# EasyEDA Pro project CogletESP_2026-02-24.epro, schematic Proto-Coglet
Board Name: Board1; Create Date: 2025-12-02; Page Name: P1; Project Name: CogletESP; Schematic Name: Schematic1; Update Date: 2025-12-12; Company: EasyEDA.com; Page Size: A4; Version: V1.0
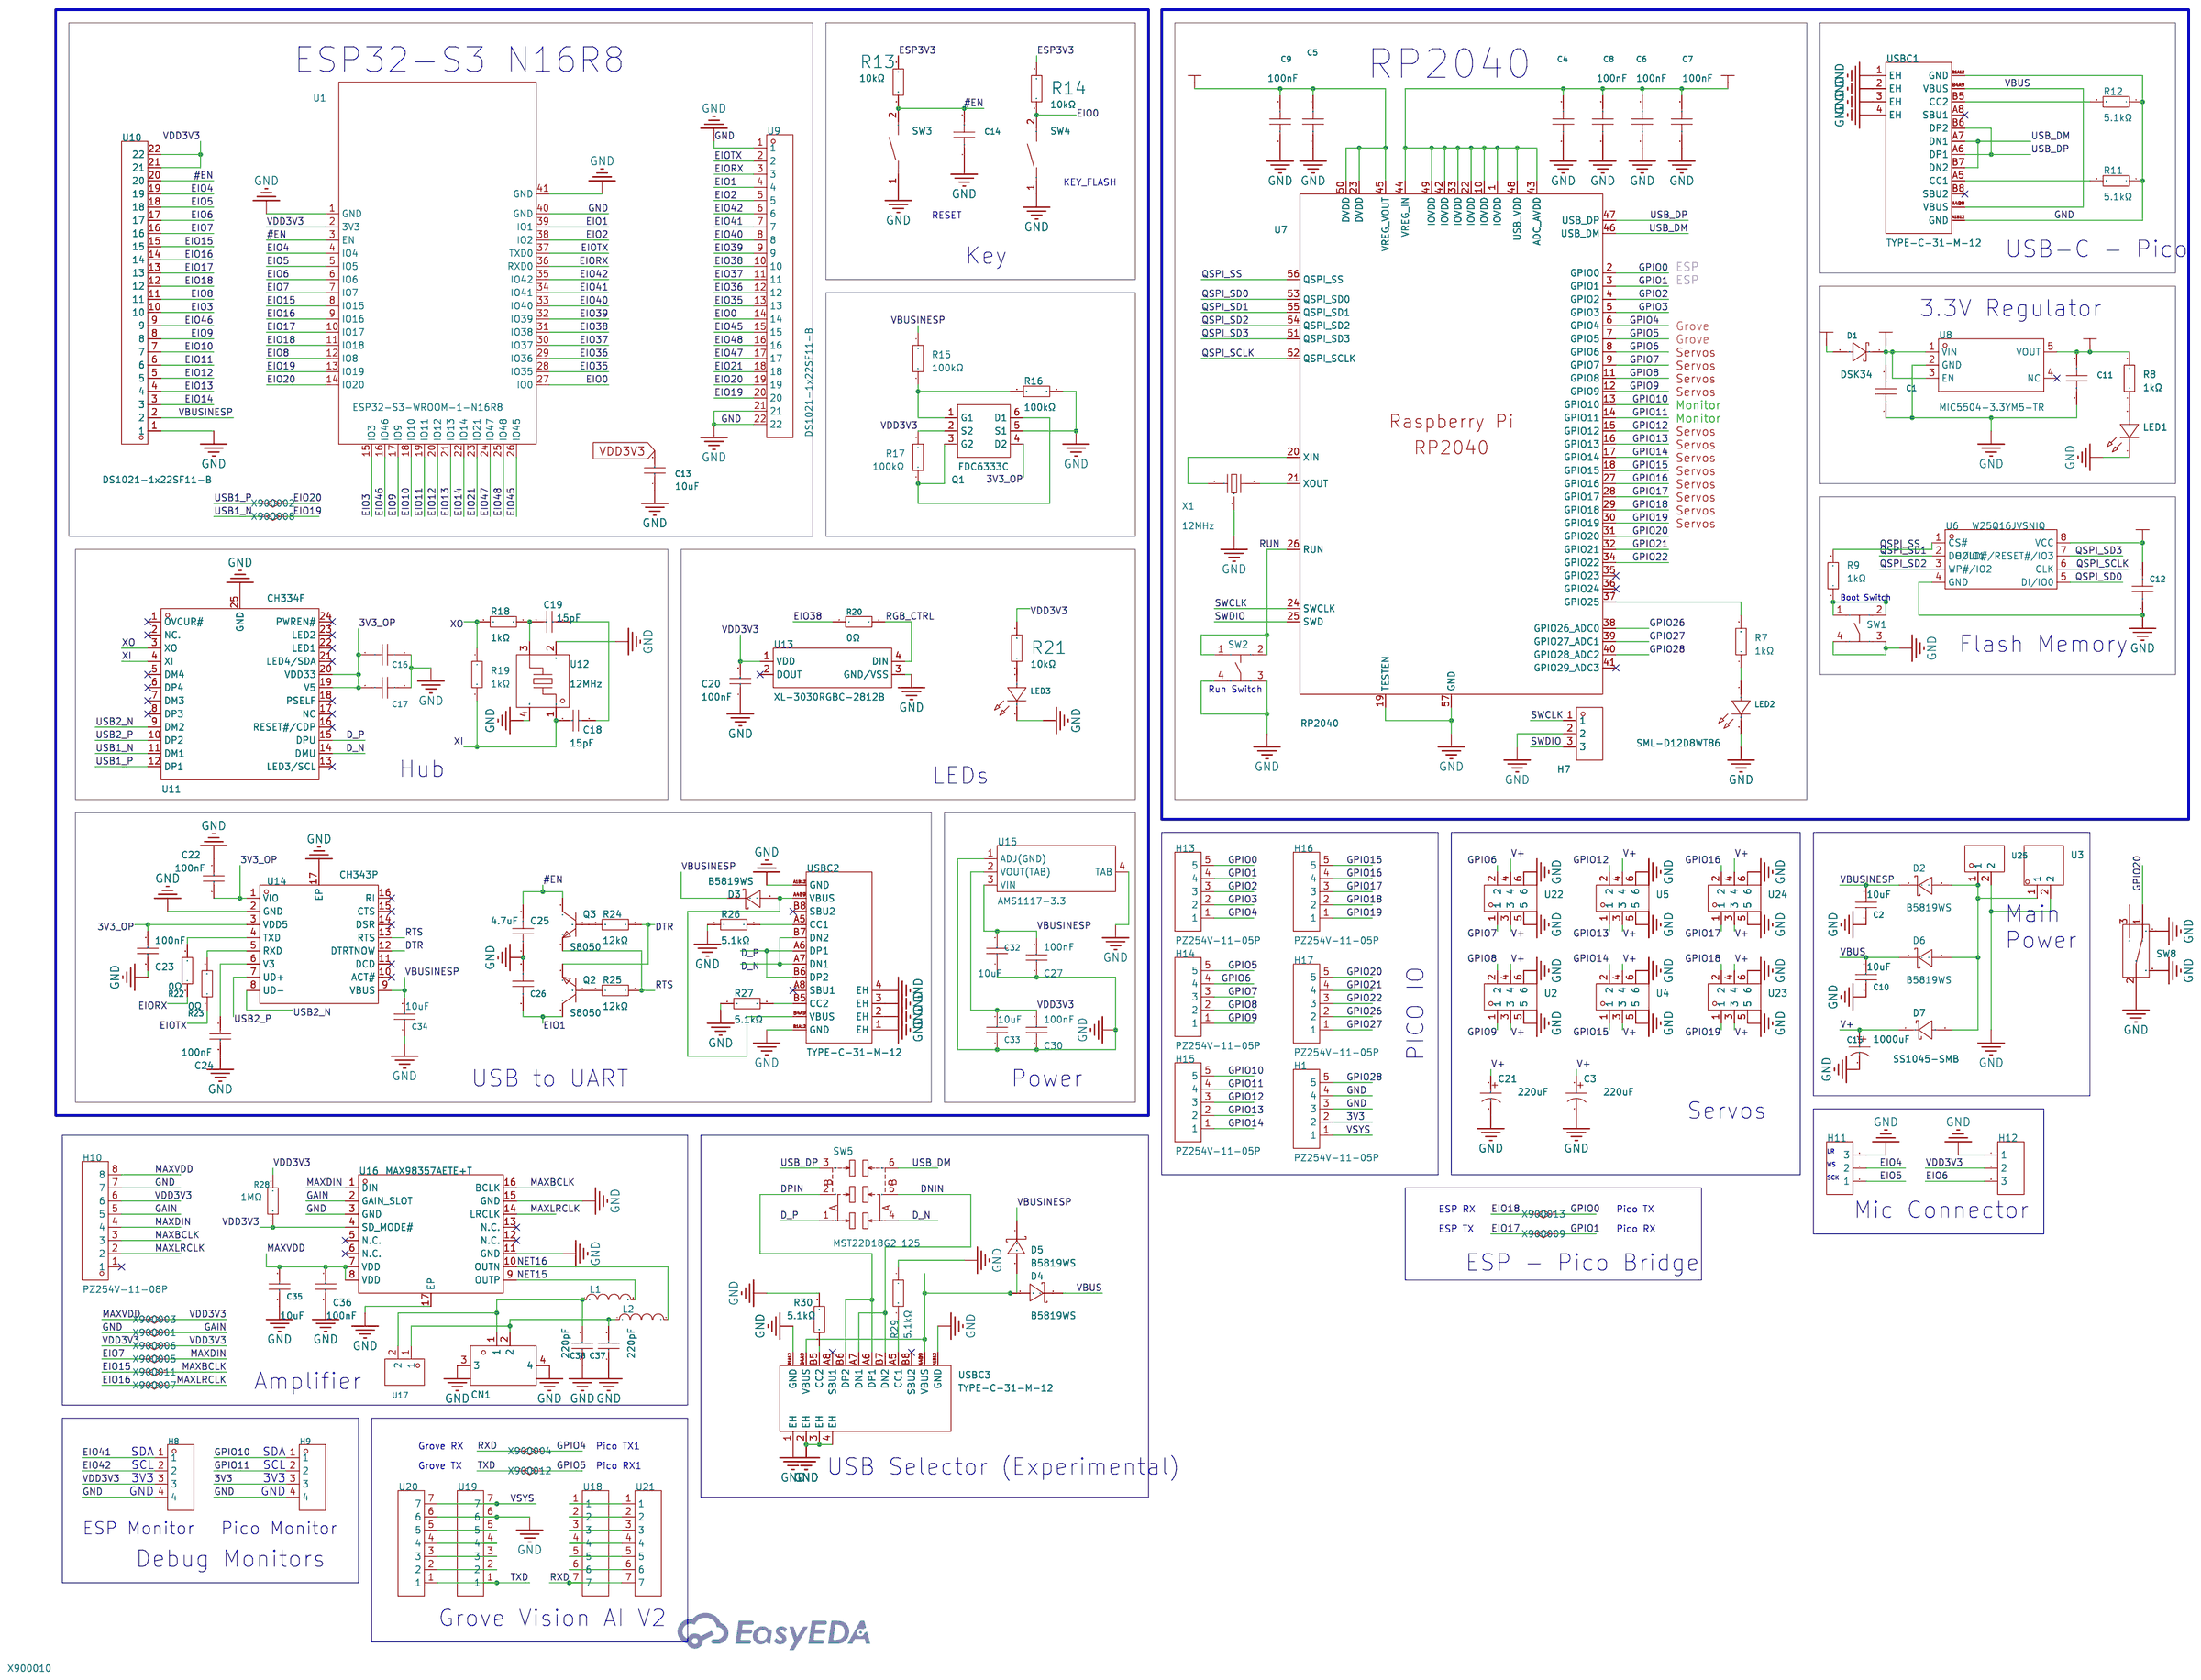
[diagram p1: schematic sheet]

## Parts
C1  1uF  [C0603]
C2  10uF  [C0603]
C3  220uF  [CAP-SMD_BD6.3-L6.6-W6.6-FD]
C4  1uF  [C0603]
C5  1uF  [C0603]
C6  100nF  [C0603]
C7  100nF  [C0603]
C8  100nF  [C0603]
C9  100nF  [C0603]
C10  10uF  [C0603]
C11  1uF  [C0603]
C12  1uF  [C0603]
C13  10uF  [C0805]
C14  1uF  [C0603]
C15  1000uF  [CAP-SMD_BD10.0-L10.3-W10.3-FD]
C16  1uF  [C0603]
C17  1uF  [C0603]
C18  15pF  [C0603]
C19  15pF  [C0603]
C20  100nF  [C0603]
C21  220uF  [CAP-SMD_BD6.3-L6.6-W6.6-FD]
C22  100nF  [C0603]
C23  100nF  [C0603]
C24  100nF  [C0603]
C25  4.7uF  [C0603]
C26  1uF  [C0603]
C27  100nF  [C0603]
C30  100nF  [C0603]
C32  10uF  [C0603]
C33  10uF  [C0603]
C34  10uF  [C0603]
C35  10uF  [C0603]
C36  100nF  [C0603]
C37  220pF  [C0603]
C38  220pF  [C0603]
CN1  HC-1.25-2PWT  [CONN-SMD_2P-P1.25-HC-1.25-2PWT]
D1  DSK34  [SOD-123_L2.8-W1.8-LS3.7-RD]
D2  B5819WS  [SOD-323_L1.8-W1.3-LS2.5-RD]
D3  B5819WS  [SOD-323_L1.8-W1.3-LS2.5-RD]
D4  B5819WS  [SOD-323_L1.8-W1.3-LS2.5-RD]
D5  B5819WS  [SOD-323_L1.8-W1.3-LS2.5-RD]
D6  B5819WS  [SOD-323_L1.8-W1.3-LS2.5-RD]
D7  SS1045-SMB  [SMB_L4.4-W3.6-LS5.3-RD]
H1  PZ254V-11-05P  [HDR-TH_5P-P2.54-V-M]
H7  X6511WV-03H-C60D30  [HDR-TH_3P-P2.54-V-M]  (no BOM)
H8  PZ254V-11-04P  [HDR-TH_4P-P2.54-V-M]
H9  PZ254V-11-04P  [HDR-TH_4P-P2.54-V-M]
H10  PZ254V-11-08P  [HDR-TH_8P-P2.54-V-M]  (no BOM)
H11  2.54-1*3P针  [HDR-TH_3P-P2.54-V-M-1]
H12  2.54-1*3P针  [HDR-TH_3P-P2.54-V-M-1]
H13  PZ254V-11-05P  [HDR-TH_5P-P2.54-V-M]
H14  PZ254V-11-05P  [HDR-TH_5P-P2.54-V-M]
H15  PZ254V-11-05P  [HDR-TH_5P-P2.54-V-M]
H16  PZ254V-11-05P  [HDR-TH_5P-P2.54-V-M]
H17  PZ254V-11-05P  [HDR-TH_5P-P2.54-V-M]
L1  BLM18PG121SN1D  [L0603]
L2  BLM18PG121SN1D  [L0603]
LED1  SML-D12P8WT86  [LED0603-RD_GREEN]
LED2  SML-D12D8WT86  [LED0603-R-RD_AMBER]
LED3  SML-D12D8WT86  [LED0603-R-RD_AMBER]
Q1  FDC6333C  [SOT-23-6_L2.9-W1.6-P0.95-LS2.8-BL]
Q2  S8050  [SOT-23-3_L3.0-W1.7-P0.95-LS2.9-BR]
Q3  S8050  [SOT-23-3_L3.0-W1.7-P0.95-LS2.9-BR]
R7  1kΩ  [R0603]
R8  1kΩ  [R0603]
R9  1kΩ  [R0603]
R11  5.1kΩ  [R0402]
R12  5.1kΩ  [R0402]
R13  10kΩ  [R0603]
R14  10kΩ  [R0603]
R15  100kΩ  [R0603]
R16  100kΩ  [R0603]
R17  100kΩ  [R0603]
R18  1kΩ  [R0603]
R19  1kΩ  [R0603]  (no BOM)
R20  0Ω  [R0603]
R21  10kΩ  [R0603]
R22  0Ω  [R0603]
R23  0Ω  [R0603]
R24  12kΩ  [R0603]
R25  12kΩ  [R0603]
R26  5.1kΩ  [R0402]
R27  5.1kΩ  [R0402]
R28  1MΩ  [R0603]
R29  5.1kΩ  [R0402]
R30  5.1kΩ  [R0402]
SW1  SKRPACE010  [KEY-SMD_4P-L4.2-W3.2-P2.20-LS4.6]
SW2  SKRPACE010  [KEY-SMD_4P-L4.2-W3.2-P2.20-LS4.6]
SW3  TS-1088-AR02016  [SW-SMD_L3.9-W3.0-P4.45]
SW4  TS-1088-AR02016  [SW-SMD_L3.9-W3.0-P4.45]
SW5  MST22D18G2 125  [SW-SMD_MST22D18G2]
SW8  SS-12D02-VG4  [SW-TH_SS-12D02-VG4]
U1  ESP32-S3-WROOM-1-N16R8  [WIRELM-SMD_ESP32-S3-WROOM-1]
U2  HX PZ2.54-3x2P ZZ  [HDR-TH_6P-P2.54-V-M-R3-C2-S2.54_2]
U3  S2B-PH-K-S(LF)(SN)  [CONN-TH_S2B-PH-K-S-LF-SN]
U4  HX PZ2.54-3x2P ZZ  [HDR-TH_6P-P2.54-V-M-R3-C2-S2.54_2]
U5  HX PZ2.54-3x2P ZZ  [HDR-TH_6P-P2.54-V-M-R3-C2-S2.54_2]
U6  W25Q16JVSNIQ  [SOP-8_L4.9-W3.9-P1.27-LS6.0-BL]
U7  RP2040  [LQFN-56_L7.0-W7.0-P0.4-EP]
U8  MIC5504-3.3YM5-TR  [SOT-23-5_L3.0-W1.7-P0.95-LS2.8-TL]
U9  DS1021-1x22SF11-B  [HDR-TH_22P-P2.54-V-M]  (no BOM)
U10  DS1021-1x22SF11-B  [HDR-TH_22P-P2.54-V-M]  (no BOM)
U11  CH334F  [QFN-24_L4.0-W4.0-P0.50-BL-EP2.8]
U12  12MHz  [CRYSTAL-SMD_4P-L3.2-W2.5-BL]
U13  XL-3030RGBC-2812B  [LED-SMD_4P-L3.0-W3.0-P2.00-LS3.1_YKL-3030AY0203Z-001]
U14  CH343P  [TQFN-16_L3.0-W3.0-P0.50-BL-EP1.7]
U15  AMS1117-3.3  [SOT-223-4_L6.5-W3.5-P2.30-LS7.0-BR]
U16  MAX98357AETE+T  [TQFN-16_L3.0-W3.0-P0.50-BL-EP1.5]
U17  KF301-5.0-2P  [CONN-TH_P5.00_KF301-5.0-2P]
U18  HB-PH3-25417PB2GOP  [HDR-TH_7P-P2.54-V-M]
U19  HB-PH3-25417PB2GOP  [HDR-TH_7P-P2.54-V-M]
U20  HB-PH3-25417PB2GOP  [HDR-TH_7P-P2.54-V-M]  (no BOM)
U21  HB-PH3-25417PB2GOP  [HDR-TH_7P-P2.54-V-M]  (no BOM)
U22  HX PZ2.54-3x2P ZZ  [HDR-TH_6P-P2.54-V-M-R3-C2-S2.54_2]
U23  HX PZ2.54-3x2P ZZ  [HDR-TH_6P-P2.54-V-M-R3-C2-S2.54_2]
U24  HX PZ2.54-3x2P ZZ  [HDR-TH_6P-P2.54-V-M-R3-C2-S2.54_2]
U25  KF301-5.0-2P  [CONN-TH_P5.00_KF301-5.0-2P]
USBC1  TYPE-C-31-M-12  [USB-C_SMD-TYPE-C-31-M-12_1]
USBC2  TYPE-C-31-M-12  [USB-C_SMD-TYPE-C-31-M-12_1]
USBC3  TYPE-C-31-M-12  [USB-C_SMD-TYPE-C-31-M-12_1]
X1  12MHz  [CRYSTAL-SMD_3P-L3.2-W1.3-P1.2-BL]

## Library data of the parts
C1 C4 C5 C11 C12 C14 C16 C17 C26 = CL10A105KB8NNNC: Capacitance: Tolerance:±10% Tolerance:±10% Voltage Rated: Temperature Coefficient:; LCSC Part Name: 1uF ±10% 50V; Supplier Part: C15849; Manufacturer: SAMSUNG(三星); Supplier Footprint: 0603; JLCPCB Part Class: Basic Part; Datasheet: https://atta.szlcsc.com/upload/public/pdf/source/20160218/1457707763339.pdf; Supplier: LCSC; Tolerance: ±10%
C2 C10 C32-C35 = CL10A106MO8NQNC: Capacitance:10uF Tolerance:±20% Tolerance:±20% Voltage Rating:16V Temperature Coefficient:X5R; LCSC Part Name: 10uF ±20% 16V; Supplier Part: C92487; Manufacturer: SAMSUNG(三星); Supplier Footprint: 0603; JLCPCB Part Class: Extended Part; Datasheet: https://item.szlcsc.com/datasheet/CL10A106MO8NQNC/93680.html; Supplier: LCSC; Tolerance: ±20%; Voltage Rating: 16V; Temperature Coefficient: X5R
C3 C21 = RVT1A221M0605_C72494: Capacitance: Tolerance:±20% Tolerance:±20% Voltage Rating: Ripple Current: Equivalent Series Resistance(ESR):- Diameter: Height - Seated (Max): Lifetime:2000hrs@105℃ Operating Temperature:-40℃~+105℃ Operating Temperature:-40℃~+105℃; LCSC Part Name: 220uF ±20% 10V; Supplier Part: C72494; Manufacturer: ROQANG(容强); Manufacturer Part: RVT1A221M0605; Supplier Footprint: SMD,D6.3xL5.4mm; JLCPCB Part Class: Extended Part; Datasheet: https://atta.szlcsc.com/upload/public/pdf/source/20170325/1490427950282.pdf; Supplier: LCSC; Tolerance: ±20%; Lifetime: 2000hrs@105℃; Operating Temperature: -40℃~+105℃
C6-C9 = CC0603KRX7R9BB104: Capacitance:100nF Tolerance:±10% Tolerance:±10% Voltage Rating:50V Temperature Coefficient:X7R; LCSC Part Name: 100nF ±10% 50V; Supplier Part: C14663; Manufacturer: YAGEO(国巨); Supplier Footprint: 0603; JLCPCB Part Class: Basic Part; Datasheet: https://item.szlcsc.com/datasheet/CC0603KRX7R9BB104/15331.html; Supplier: LCSC; Tolerance: ±10%; Temperature Coefficient: X7R; Voltage Rating: 50V
C13 = CL21A106KOQNNNE: Capacitance:10uF Tolerance:±10% Tolerance:±10% Voltage Rating:16V Temperature Coefficient:X5R; LCSC Part Name: 10uF ±10% 16V; Supplier Part: C1713; Manufacturer: SAMSUNG(三星); Supplier Footprint: 0805; JLCPCB Part Class: Extended Part; Datasheet: https://item.szlcsc.com/datasheet/CL21A106KOQNNNE/2065.html; Supplier: LCSC; Tolerance: ±10%; Voltage Rating: 16V; Temperature Coefficient: X5R
C15 = RVT1C102M1010: Capacitance: Tolerance:±20% Tolerance:±20% Rated Voltage: Ripple Current:- Equivalent Series Resistance(ESR):- φD: L: Lifetime @ Temp:2000hrs@105℃ Operating Temperature:-55℃~+105℃ Operating Temperature:-55℃~+105℃; LCSC Part Name: 1000uF ±20% 16V; Supplier Part: C3359; Manufacturer: HONOR(荣誉); Supplier Footprint: SMD,D10xL10.2mm; JLCPCB Part Class: Extended Part; Datasheet: https://atta.szlcsc.com/upload/public/pdf/source/20210521/C113284_25C86AE95FB541053FE695F13EA8E7D0.pdf; Supplier: LCSC; Tolerance: ±20%; Lifetime @ Temp: 2000hrs@105℃; Operating Temperature: -55℃~+105℃
C18 C19 = CL10C150JB8NNNC: Capacitance:15pF Tolerance:±5% Tolerance:±5% Voltage Rating:50V Temperature Coefficient:C0G; LCSC Part Name: 15pF ±5% 50V; Supplier Part: C1644; Manufacturer: SAMSUNG(三星); Supplier Footprint: 0603; JLCPCB Part Class: Basic Part; Datasheet: https://item.szlcsc.com/datasheet/CL10C150JB8NNNC/1996.html; Supplier: LCSC; Tolerance: ±5%; Voltage Rating: 50V; Temperature Coefficient: C0G
C20 C22-C24 C27 C30 C36 = CL10B104KA8NNNC: Capacitance:100nF Tolerance:±10% Tolerance:±10% Voltage Rating:25V Temperature Coefficient:X7R; LCSC Part Name: 100nF ±10% 25V; Supplier Part: C1590; Manufacturer: SAMSUNG(三星); Supplier Footprint: 0603; JLCPCB Part Class: Extended Part; Datasheet: https://item.szlcsc.com/datasheet/CL10B104KA8NNNC/1942.html; Supplier: LCSC; Tolerance: ±10%; Voltage Rating: 25V; Temperature Coefficient: X7R
C25 = CL10A475KO8NNNC: Capacitance:4.7uF Tolerance:±10% Tolerance:±10% Voltage Rating:16V Temperature Coefficient:X5R; LCSC Part Name: 4.7uF ±10% 16V; Supplier Part: C19666; Manufacturer: SAMSUNG(三星); Supplier Footprint: 0603; JLCPCB Part Class: Basic Part; Datasheet: https://item.szlcsc.com/datasheet/CL10A475KO8NNNC/20375.html; Supplier: LCSC; Tolerance: ±10%; Voltage Rating: 16V; Temperature Coefficient: X5R
C37 C38 = CL10B221KB8NNNC: Capacitance:220pF Tolerance:±10% Tolerance:±10% Voltage Rating:50V Temperature Coefficient:X7R; LCSC Part Name: 220pF ±10% 50V; Supplier Part: C1603; Manufacturer: SAMSUNG(三星); Supplier Footprint: 0603; JLCPCB Part Class: Basic Part; Datasheet: https://item.szlcsc.com/datasheet/CL10B221KB8NNNC/1955.html; Supplier: LCSC; Tolerance: ±10%; Voltage Rating: 50V; Temperature Coefficient: X7R
CN1 = HC-1.25-2PWT: Pins Structure:1x2P Pitch:1.25mm Mounting Style:Horizontal attachment Reference Series:PicoBlade(MX 1.25) Number of Pins:2P Number of Rows:1 Number of PINs Per Row:2 Row Spacing:- Current Rating (Max):1A Contact Material:Brass Contact Plating:Tin Operatin; LCSC Part Name: 1x2P 间距:1.25mm 卧贴 系列:PicoBlade(MX 1.25); Supplier Part: C2845379; Manufacturer: HCTL(华灿天禄); Supplier Footprint: SMD,P=1.25mm,卧贴; JLCPCB Part Class: Extended Part; Datasheet: https://atta.szlcsc.com/upload/public/pdf/source/20240930/9508A8292CCC87B0C29E3A028D56E30A.pdf; Supplier: LCSC; Pins Structure: 1x2P; Pitch: 1.25mm; Mounting Style: Horizontal attachment; Reference Series: PicoBlade(MX 1.25); Number of Pins: 2P; Number of Rows: 1; Number of PINs Per Row: 2; Current Rating (Max): 1A; Contact Material: Brass; Contact Plating: Tin; Operating Temperature Range: -40℃~+105℃; Rated Voltage (Max): 125V; Plastic Material: LCP; Flame Retardant Rating: UL94V-0; Supplementary Features: Auxiliary soldering legs; Z-Height of the Board: 3.57mm; X-Length of Bottom Edge on Board (Spacing Line): 7.55mm; Y-Width of Bottom Edge on Board: 5.25mm
D1 = DSK34_C41029: Diode Configuration:Independent Type Forward Voltage (Vf@If):550mV@3A Reverse Voltage (Vr):40V Rectified Current:3A Reverse Leakage Current (Ir):500uA@40V; LCSC Part Name: 电压:40V 电流:3A; Supplier Part: C41029; Manufacturer: MDD(辰达半导体); Supplier Footprint: SOD-123FL; JLCPCB Part Class: Extended Part; Datasheet: https://atta.szlcsc.com/upload/public/pdf/source/20240710/931B7979AEEE628A0AE48522F9F6A0BB.pdf; Supplier: LCSC; Diode Configuration: Independent Type; Forward Voltage (Vf@If): 550mV@3A; Reverse Voltage (Vr): 40V; Rectified Current: 3A; Reverse Leakage Current (Ir): 500uA@40V
D2-D6 = B5819WS_C64886: Diode Configuration:Independent Voltage - Forward(Vf@If):900mV@3A Voltage - DC Reverse(Vr):40V Current - Rectified:1A Reverse Leakage Current (Ir):1mA@40V Operating Junction Temperature Range:-55℃~+125℃ Operating Junction Temperature Range:-55℃~+125℃ Non-; LCSC Part Name: 丝印SL 电压:40V 电流:1A; Supplier Part: C64886; Manufacturer: MDD(辰达半导体); Supplier Footprint: SOD-323; JLCPCB Part Class: Extended Part; Datasheet: https://item.szlcsc.com/datasheet/B5819WS/65956.html; Supplier: LCSC; Diode Configuration: Independent; Voltage - Forward(Vf@If): 900mV@3A; Voltage - DC Reverse(Vr): 40V; Current - Rectified: 1A; Reverse Leakage Current (Ir): 1mA@40V; Operating Junction Temperature Range: -55℃~+125℃; Non-Repetitive Peak Forward Surge Current: 25A
D7 = SS1045-SMB: Diode Configuration:Independent Type Voltage - Forward(Vf@If):550mV@10A Voltage - DC Reverse(Vr):45V Current - Rectified:10A Reverse Leakage Current (Ir):100nA; LCSC Part Name: 电压:45V 电流:10A; Supplier Part: C2903947; Manufacturer: GOODWORK(固得沃克); Supplier Footprint: SMB(DO-214AA); JLCPCB Part Class: Extended Part; Datasheet: https://atta.szlcsc.com/upload/public/pdf/source/20240617/4C132C80E36BDBE9AB2C039856844535.pdf; Supplier: LCSC; Diode Configuration: Independent Type; Voltage - Forward(Vf@If): 550mV@10A; Voltage - DC Reverse(Vr): 45V; Current - Rectified: 10A; Reverse Leakage Current (Ir): 100nA
H1 H13-H17 = PZ254V-11-05P: Pin Structure:1x5P Pitch:2.54mm Row Spacing:- Circluar Pins/Square Pins:Pin Header Mounting Type:Through Hole Number of Rows:1 Number of Pins:5P Current Rating:- Voltage Rating (Max):- Length of Mating Pin:6mm Insulation Height:2.5mm Length of End Connect; LCSC Part Name: 1x5P 间距:2.54mm 方针 直插; Supplier Part: C492404; Manufacturer: XFCN(兴飞); Supplier Footprint: 插件,P=2.54mm; JLCPCB Part Class: Extended Part; Datasheet: https://item.szlcsc.com/datasheet/PZ254V-11-05P/502960.html; Supplier: LCSC; Pin Structure: 1x5P; Pitch: 2.54mm; Circluar Pins/Square Pins: Pin Header; Mounting Type: Through Hole; Number of Rows: 1; Number of Pins: 5P; Length of Mating Pin: 6mm; Insulation Height: 2.5mm; Length of End Connection Pin: 3mm; Contact Material: Brass; Operating Temperature: -40℃~+105℃; Color: Black
H7 = X6511WV-03H-C60D30: Pin Structure:1x3P Pitch:2.54mm Row Spacing:- Circluar Pins/Square Pins:Square Pins Mounting Type:- Number of Rows:Plugin Number of Pins:3P Current Rating (Max):3A Voltage Rating (Max):250V Length of Mating Pin:- Insulation Height:2.5mm Length of End Conn; LCSC Part Name: 1x3P 间距:2.54mm 方针; Supplier Part: C706875; Manufacturer: XKB Connection(中国星坤); Supplier Footprint: 插件,P=2.54mm; JLCPCB Part Class: Extended Part; Datasheet: https://atta.szlcsc.com/upload/public/pdf/source/20221108/2FDDF9C694C8EDC81165E23F2EAAE597.pdf; Supplier: LCSC; Pin Structure: 1x3P; Pitch: 2.54mm; Circluar Pins/Square Pins: Square Pins; Number of Rows: Plugin; Number of Pins: 3P; Current Rating (Max): 3A; Voltage Rating (Max): 250V; Insulation Height: 2.5mm; Contact Plating: Gold; Operating Temperature Range: -40℃~+105℃; Soldering Temperature(Max): 260℃; Color: Black
H8 H9 = PZ254V-11-04P: Pin Structure:1x4P Pitch:2.54mm Row Spacing:- Circluar Pins/Square Pins:Pin Header Mounting Type:Through Hole Number of Rows:1 Number of Pins:4P Current Rating:3A Voltage Rating (Max):250V Length of Mating Pin:6mm Insulation Height:2.5mm Length of End Con; LCSC Part Name: 1x4P 间距:2.54mm 方针 直插; Supplier Part: C2691448; Manufacturer: XFCN(兴飞); Supplier Footprint: 插件,P=2.54mm; JLCPCB Part Class: Extended Part; Datasheet: https://item.szlcsc.com/datasheet/PZ254V-11-04P/2801085.html; Supplier: LCSC; Pin Structure: 1x4P; Pitch: 2.54mm; Circluar Pins/Square Pins: Pin Header; Mounting Type: Through Hole; Number of Rows: 1; Number of Pins: 4P; Current Rating: 3A; Voltage Rating (Max): 250V; Length of Mating Pin: 6mm; Insulation Height: 2.5mm; Length of End Connection Pin: 3mm; Operating Temperature: -40℃~+105℃; Color: Black
H10 = PZ254V-11-08P: Pin Structure:1x8P Pitch:2.54mm Row Spacing:- Circluar Pins/Square Pins:Pin Header Mounting Type:Through Hole Number of Rows:1 Number of Pins:8P Current Rating:- Voltage Rating (Max):- Length of Mating Pin:6mm Insulation Height:2.5mm Length of End Connect; LCSC Part Name: 1x8P 间距:2.54mm 方针 直插; Supplier Part: C492407; Manufacturer: XFCN(兴飞); Supplier Footprint: 插件,P=2.54mm; JLCPCB Part Class: Extended Part; Datasheet: https://item.szlcsc.com/datasheet/PZ254V-11-08P/502963.html; Supplier: LCSC; Pin Structure: 1x8P; Pitch: 2.54mm; Circluar Pins/Square Pins: Pin Header; Mounting Type: Through Hole; Number of Rows: 1; Number of Pins: 8P; Length of Mating Pin: 6mm; Insulation Height: 2.5mm; Length of End Connection Pin: 3mm; Contact Material: Brass; Operating Temperature: -40℃~+105℃; Color: Black
H11 H12 = 2.54-1*3P针: Pin Structure:1x3P Pitch:2.54mm Row Spacing:- Circluar Pins/Square Pins:Pin Header Mounting Type:Through Hole Number of Rows:1 Number of Pins:3P Current Rating:3A Voltage Rating (Max):- Length of Mating Pin:6mm Insulation Height:2.5mm Length of End Connec; LCSC Part Name: 1x3P 间距:2.54mm 方针 直插; Supplier Part: C49257; Manufacturer: BOOMELE(博穆精密); Supplier Footprint: 插件,P=2.54mm; JLCPCB Part Class: Extended Part; Datasheet: https://item.szlcsc.com/datasheet/2.54-1*3P%25E9%2592%2588/50265.html; Supplier: LCSC; Pin Structure: 1x3P; Pitch: 2.54mm; Circluar Pins/Square Pins: Pin Header; Mounting Type: Through Hole; Number of Rows: 1; Number of Pins: 3P; Current Rating: 3A; Length of Mating Pin: 6mm; Insulation Height: 2.5mm; Length of End Connection Pin: 3mm; Contact Material: Brass; Contact Plating: Gold; Operating Temperature: -40℃~+105℃; Color: Black
L1 L2 = BLM18PG121SN1D_C14709: Impedance @ Frequency:120Ω@100MHz Tolerance:±25% Tolerance:±25% DC Resistance(DCR):50mΩ Current Rating:2A Number of Circuits:1 Operating Temperature:-55℃~+125℃ Operating Temperature:-55℃~+125℃; LCSC Part Name: 单路 0603磁珠 阻抗120Ω@100MHz; Supplier Part: C14709; Manufacturer: muRata(村田); Supplier Footprint: 0603; JLCPCB Part Class: Basic Part; Datasheet: https://item.szlcsc.com/datasheet/BLM18PG121SN1D/15379.html; Supplier: LCSC; Impedance @ Frequency: 120Ω@100MHz; Tolerance: ±25%; DC Resistance(DCR): 50mΩ; Current Rating: 2A; Number of Circuits: 1; Operating Temperature: -55℃~+125℃
LED1 = SML-D12P8WT86: Emitted Color:Green-yellow Forward Voltage (VF):2.2V Forward Voltage (VF):2.2V Power Dissipation:54mW Forward Current:20mA Dominant Wavelength:560nm Dominant Wavelength:560nm Peak Wavelength:- Diode Configuration:- Lens Color:白色透镜 Color Temperature:- Colo; LCSC Part Name: 普绿/黄绿; Supplier Part: C510026; Manufacturer: ROHM(罗姆); Supplier Footprint: 0603; JLCPCB Part Class: Extended Part; Datasheet: https://atta.szlcsc.com/upload/public/pdf/source/20201028/C510025_17C36021E4F76BF48F6AD66EDB30A43C.pdf; Supplier: LCSC; Emitted Color: Green-yellow; Forward Voltage (VF): 2.2V; Power Dissipation: 54mW; Forward Current: 20mA; Dominant Wavelength: 560nm; Lens Color: 白色透镜; Luminous Intensity: 6.3mcd; Operating Temperature: -40℃~+85℃
LED2 LED3 = SML-D12D8WT86: Emitted Color:Amber Color Forward Voltage (VF):2.2V Forward Voltage (VF):2.2V Power Dissipation:54mW Forward Current:20mA Dominant Wavelength:605nm Dominant Wavelength:605nm Peak Wavelength:- Diode Configuration:- Lens Color:白色透镜 Color Temperature:- Color; LCSC Part Name: 琥珀; Supplier Part: C510024; Manufacturer: ROHM(罗姆); Supplier Footprint: 0603; JLCPCB Part Class: Extended Part; Datasheet: https://atta.szlcsc.com/upload/public/pdf/source/20201028/C510025_17C36021E4F76BF48F6AD66EDB30A43C.pdf; Supplier: LCSC; Emitted Color: Amber Color; Forward Voltage (VF): 2.2V; Power Dissipation: 54mW; Forward Current: 20mA; Dominant Wavelength: 605nm; Lens Color: 白色透镜; Luminous Intensity: 100mcd; Operating Temperature: -40℃~+85℃
Q1 = FDC6333C_C5182070: Drain to Source Voltage:30V；30V Current - Continuous Drain(Id):4A；3A RDS(on):30mΩ@10V；45mΩ@10V Gate Threshold Voltage (Vgs(th)):1.6V@250uA；1.5V@250uA Gate Charge(Qg):5nC@10V；5nC@10V Input Capacitance(Ciss):199pF；210pF Reverse Transfer Capacitance (Crss@Vd; LCSC Part Name: N沟道和P沟道增强型功率MOSFET; Supplier Part: C5182070; Manufacturer: TECH PUBLIC(台舟); Supplier Footprint: SOT-23-6; JLCPCB Part Class: Extended Part; Datasheet: https://item.szlcsc.com/datasheet/FDC6333C/5842210.html; Supplier: LCSC; Drain to Source Voltage: 30V；30V; Current - Continuous Drain(Id): 4A；3A; RDS(on): 30mΩ@10V；45mΩ@10V; Gate Threshold Voltage (Vgs(th)): 1.6V@250uA；1.5V@250uA; Gate Charge(Qg): 5nC@10V；5nC@10V; Input Capacitance(Ciss): 199pF；210pF; Reverse Transfer Capacitance (Crss@Vds): 23pF；28pF; Operating Temperature: -55℃~+150℃; Type: N-Channel + P-Channel; Output Capacitance(Coss): 35pF；47pF
Q2 Q3 = S8050 J3Y(RANGE:200-350): type:NPN Current - Collector(Ic):500mA Collector - Emitter Voltage VCEO:25V Pd - Power Dissipation:300mW DC Current Gain:200@500mA,1V DC Current Gain:200@500mA,1V Transition frequency(fT):150MHz Current - Collector Cutoff:100nA Vce Saturation(VCE(sat)):60; LCSC Part Name: H档(200-350) NPN 电流:0.5A 电压:25V; Supplier Part: C2146; Manufacturer: CJ(江苏长电/长晶); Supplier Footprint: SOT-23; JLCPCB Part Class: Basic Part; Datasheet: https://item.szlcsc.com/datasheet/S8050%2520J3Y(RANGE%253A200-350)/2503.html; Supplier: LCSC; type: NPN; Current - Collector(Ic): 500mA; Collector - Emitter Voltage VCEO: 25V; Pd - Power Dissipation: 300mW; DC Current Gain: 200@500mA,1V; Transition frequency(fT): 150MHz; Current - Collector Cutoff: 100nA; Vce Saturation(VCE(sat)): 600mV@500mA,50mA; Operating Temperature: -55℃~+150℃; Emitter-Base Voltage(Vebo): 5V; Number: 1 NPN
R7-R9 R18 R19 = RC0603JR-071KL: Type:Thick Film Resistors Resistance: Tolerance:±5% Tolerance:±5% Power(Watts): Overload Voltage (Max): Temperature Coefficient:±100ppm/℃ Temperature Coefficient:±100ppm/℃ Operating Temperature Range:-55℃~+155℃ Operating Temperature Range:-55℃~+155℃; LCSC Part Name: 厚膜电阻 1kΩ ±5% 100mW; Supplier Part: C14676; Manufacturer: YAGEO(国巨); Supplier Footprint: 0603; JLCPCB Part Class: Extended Part; Datasheet: https://atta.szlcsc.com/upload/public/pdf/source/20180312/878C51D17DCD6F9A3FE54FC2E3312A77.pdf; Supplier: LCSC; Type: Thick Film Resistors; Tolerance: ±5%; Temperature Coefficient: ±100ppm/℃; Operating Temperature Range: -55℃~+155℃
R11 R12 R26 R27 R29 R30 = 0402WGF5101TCE: Type:Thick Film Resistors Resistance:5.1kΩ Tolerance:±1% Tolerance:±1% Power(Watts): Overload Voltage (Max): Temperature Coefficient:±100ppm/℃ Temperature Coefficient:±100ppm/℃ Operating Temperature Range:-55℃~+155℃ Operating Temperature Range:-55℃~+155℃; LCSC Part Name: 5.1kΩ ±1% 62.5mW 厚膜电阻; Supplier Part: C25905; Manufacturer: UNI-ROYAL(厚声); Supplier Footprint: 0402; JLCPCB Part Class: Basic Part; Datasheet: https://atta.szlcsc.com/upload/public/pdf/source/20200306/C422600_1E6D84923E4A46A82E41ADD87F860B5C.pdf; Supplier: LCSC; Type: Thick Film Resistors; Tolerance: ±1%; Temperature Coefficient: ±100ppm/℃; Operating Temperature Range: -55℃~+155℃
R13 R14 R21 = 0603WAF1002T5E: Type:Thick Film Resistor Resistance:10kΩ Tolerance:±1% Tolerance:±1% Power(Watts):100mW Voltage-Supply(Max):75V Temperature Coefficient:±100ppm/℃ Temperature Coefficient:±100ppm/℃ Operating Temperature:-55℃~+155℃ Operating Temperature:-55℃~+155℃; LCSC Part Name: 厚膜电阻 10kΩ ±1% 100mW; Supplier Part: C25804; Manufacturer: UNI-ROYAL(厚声); Supplier Footprint: 0603; JLCPCB Part Class: Basic Part; Datasheet: https://item.szlcsc.com/datasheet/0603WAF1002T5E/26547.html; Supplier: LCSC; Type: Thick Film Resistor; Tolerance: ±1%; Power(Watts): 100mW; Voltage-Supply(Max): 75V; Temperature Coefficient: ±100ppm/℃; Operating Temperature: -55℃~+155℃
R15-R17 = 0603WAF1003T5E: Type:Thick Film Resistor Resistance:100kΩ Tolerance:±1% Tolerance:±1% Power(Watts):100mW Voltage-Supply(Max):75V Temperature Coefficient:±100ppm/℃ Temperature Coefficient:±100ppm/℃ Operating Temperature:-55℃~+155℃ Operating Temperature:-55℃~+155℃; LCSC Part Name: 100kΩ ±1% 100mW 厚膜电阻; Supplier Part: C25803; Manufacturer: UNI-ROYAL(厚声); Supplier Footprint: 0603; JLCPCB Part Class: Basic Part; Datasheet: https://item.szlcsc.com/datasheet/0603WAF1003T5E/26546.html; Supplier: LCSC; Type: Thick Film Resistor; Tolerance: ±1%; Power(Watts): 100mW; Voltage-Supply(Max): 75V; Temperature Coefficient: ±100ppm/℃; Operating Temperature: -55℃~+155℃
R20 R22 R23 = 0603WAJ0000T5E: Type:Thick Film Resistor Resistance:0Ω Tolerance:±5% Tolerance:±5% Power(Watts):100mW Voltage-Supply(Max):75V Temperature Coefficient:±800ppm/℃ Temperature Coefficient:±800ppm/℃ Operating Temperature:-55℃~+155℃ Operating Temperature:-55℃~+155℃; LCSC Part Name: 0Ω ±5% 100mW 厚膜电阻; Supplier Part: C15402; Manufacturer: UNI-ROYAL(厚声); Supplier Footprint: 0603; JLCPCB Part Class: Extended Part; Datasheet: https://item.szlcsc.com/datasheet/0603WAJ0000T5E/16080.html; Supplier: LCSC; Type: Thick Film Resistor; Tolerance: ±5%; Power(Watts): 100mW; Voltage-Supply(Max): 75V; Temperature Coefficient: ±800ppm/℃; Operating Temperature: -55℃~+155℃
R24 R25 = 0603WAF1202T5E: Type:Thick Film Resistor Resistance:12kΩ Tolerance:±1% Tolerance:±1% Power(Watts):100mW Voltage-Supply(Max):75V Temperature Coefficient:±100ppm/℃ Temperature Coefficient:±100ppm/℃ Operating Temperature:-55℃~+155℃ Operating Temperature:-55℃~+155℃; LCSC Part Name: 12kΩ ±1% 100mW 厚膜电阻; Supplier Part: C22790; Manufacturer: UNI-ROYAL(厚声); Supplier Footprint: 0603; JLCPCB Part Class: Basic Part; Datasheet: https://item.szlcsc.com/datasheet/0603WAF1202T5E/23517.html; Supplier: LCSC; Type: Thick Film Resistor; Tolerance: ±1%; Power(Watts): 100mW; Voltage-Supply(Max): 75V; Temperature Coefficient: ±100ppm/℃; Operating Temperature: -55℃~+155℃
R28 = 0603WAF1004T5E: Type:Thick Film Resistors Resistance:1MΩ Tolerance:±1% Tolerance:±1% Power(Watts): Overload Voltage (Max): Temperature Coefficient:±100ppm/℃ Temperature Coefficient:±100ppm/℃ Operating Temperature Range:-55℃~+155℃ Operating Temperature Range:-55℃~+155℃; LCSC Part Name: 1MΩ ±1% 100mW 厚膜电阻; Supplier Part: C22935; Manufacturer: UNI-ROYAL(厚声); Supplier Footprint: 0603; JLCPCB Part Class: Basic Part; Datasheet: https://atta.szlcsc.com/upload/public/pdf/source/20200306/C422600_1E6D84923E4A46A82E41ADD87F860B5C.pdf; Supplier: LCSC; Type: Thick Film Resistors; Tolerance: ±1%; Temperature Coefficient: ±100ppm/℃; Operating Temperature Range: -55℃~+155℃
SW1 SW2 = SKRPACE010: Circuit:SPST Actuator Style:Oval button Mounting Style:Brick nogging Switch Length:4.2mm Switch Width:3.2mm Switch Height:2.5mm Contact Current:50mA Voltage Rating (DC):16V With Lamp:- Mechanical Life:-; LCSC Part Name: 4.2*3.2*2.5mm 立贴 轻触开关; Supplier Part: C139797; Manufacturer: ALPSALPINE(阿尔卑斯阿尔派); Supplier Footprint: SMD; JLCPCB Part Class: Extended Part; Datasheet: https://atta.szlcsc.com/upload/public/pdf/source/20171113/C139797_15105612676371115729.pdf; Supplier: LCSC; Circuit: SPST; Actuator Style: Oval button; Mounting Style: Brick nogging; Switch Length: 4.2mm; Switch Width: 3.2mm; Switch Height: 2.5mm; Contact Current: 50mA; Voltage Rating (DC): 16V
SW3 SW4 = TS-1088-AR02016: Circuit:SPST Actuator Style:Round Button Operating Force:1.6N Mounting Type:Surface Mount,Vertical Length:4mm Width:3mm Switch Height:2mm with Bracket:Without Bracket Contact Current:50mA Voltage Rating:12V Actuator/Cap Color:Black Termination Style:SMD(S; LCSC Part Name: 4*3*2mm 立贴 轻触开关; Supplier Part: C720477; Manufacturer: XUNPU(讯普); Supplier Footprint: SMD,4x3mm; JLCPCB Part Class: Basic Part; Datasheet: https://item.szlcsc.com/datasheet/TS-1088-AR02016/763484.html; Supplier: LCSC; Circuit: SPST; Actuator Style: Round Button; Operating Force: 1.6N; Mounting Type: Surface Mount,Vertical; Length: 4mm; Width: 3mm; Switch Height: 2mm; with Bracket: Without Bracket; Contact Current: 50mA; Voltage Rating: 12V; Actuator/Cap Color: Black; Termination Style: SMD(SMT) Tab; Life: 100,000 Cycles; Operating Temperature: -30℃~+80℃
SW5 = MST22D18G2 125: Circuit:DPDT Termination Style:Gull Wing Mounting Type:Surface Mount,Vertical Actuator Color:Black Current Rating:100mA Voltage Rating:12V Life:10,000 Cycles Operating Temperature:-25℃~+70℃ Operating Temperature:-25℃~+70℃; LCSC Part Name: 拨动开关/两档立式 6脚贴片 柄长2.0mm 大六立贴 9.1*3.5mm; Supplier Part: C2906280; Manufacturer: SHOU HAN(首韩); Supplier Footprint: SMD; JLCPCB Part Class: Extended Part; Datasheet: https://item.szlcsc.com/datasheet/MST22D18G2%2520125/3178990.html; Supplier: LCSC; Circuit: DPDT; Termination Style: Gull Wing; Mounting Type: Surface Mount,Vertical; Actuator Color: Black; Current Rating: 100mA; Voltage Rating: 12V; Life: 10,000 Cycles; Operating Temperature: -25℃~+70℃
SW8 = SS-12D02-VG4_C136719: Circuit:SPDT Actuator Style:Rectangular columnar Pin Style:PCPin Switch Height:8.7mm Mounting Style:Straight Current Rating (DC):- Voltage Rating (DC):- Current Rating (AC):- Voltage Rating (AC):- Mechanical Life:5千次 Operating Temperature:-25℃~+70℃ Operat; LCSC Part Name: 直插双档 滑动开关; Supplier Part: C136719; Manufacturer: 韩国韩荣; Supplier Footprint: 插件; JLCPCB Part Class: Extended Part; Datasheet: https://atta.szlcsc.com/upload/public/pdf/source/20171030/C136719_15093664985151068208.pdf; Supplier: LCSC; Circuit: SPDT; Actuator Style: Rectangular columnar; Pin Style: PCPin; Switch Height: 8.7mm; Mounting Style: Straight; Mechanical Life: 5千次; Operating Temperature: -25℃~+70℃
U1 = ESP32-S3-WROOM-1-N16R8: LCSC Part Name: 通用型Wi-Fi+低功耗蓝牙MCU模组; Supplier Part: C2913202; Manufacturer: ESPRESSIF(乐鑫); Supplier Footprint: SMD,25.5x18mm; JLCPCB Part Class: Extended Part; Datasheet: https://item.szlcsc.com/datasheet/ESP32-S3-WROOM-1-N16R8/3198300.html; Supplier: LCSC
U2 U4 U5 U22-U24 = HX PZ2.54-3x2P ZZ: Pin Structure:3x2P Pitch:2.54mm Row Spacing:2.54mm Circluar Pins/Square Pins:Pin Header Mounting Type:Through Hole Number of Rows:3 Number of Pins:6P Current Rating:3A Voltage Rating (Max):1kV Length of Mating Pin:6mm Insulation Height:2.5mm Length of End; LCSC Part Name: 3x2P 间距:2.54mm 方针 直插; Supplier Part: C32713289; Manufacturer: hanxia(韩下); Supplier Footprint: 插件,P=2.54mm; JLCPCB Part Class: Extended Part; Datasheet: https://item.szlcsc.com/datasheet/HX%2520PZ2.54-3x2P%2520ZZ/34444569.html; Supplier: LCSC; Pin Structure: 3x2P; Pitch: 2.54mm; Row Spacing: 2.54mm; Circluar Pins/Square Pins: Pin Header; Mounting Type: Through Hole; Number of Rows: 3; Number of Pins: 6P; Current Rating: 3A; Voltage Rating (Max): 1kV; Length of Mating Pin: 6mm; Insulation Height: 2.5mm; Length of End Connection Pin: 3mm; Contact Material: Brass; Contact Plating: Gold; Operating Temperature: -40℃~+105℃; Color: Black
U3 = S2B-PH-K-S(LF)(SN): Pins Structure:1x2P Pitch:2mm Mounting Type:Right Angle Reference Series:PH Number of Pins:2P Number of Rows:1 Number of PINs Per Row:2 Row Spacing:- Current Rating:2A Contact Material:Brass Contact Plating:Tin Operating Temperature:-25℃~+85℃ Operating Te; LCSC Part Name: 1x2P 间距:2mm 弯插 系列:PH; Supplier Part: C173752; Manufacturer: JST; Supplier Footprint: 弯插,P=2mm; JLCPCB Part Class: Extended Part; Datasheet: https://item.szlcsc.com/datasheet/S2B-PH-K-S(LF)(SN)/185142.html; Supplier: LCSC; Pins Structure: 1x2P; Pitch: 2mm; Mounting Type: Right Angle; Reference Series: PH; Number of Pins: 2P; Number of Rows: 1; Number of PINs Per Row: 2; Current Rating: 2A; Contact Material: Brass; Contact Plating: Tin; Operating Temperature: -25℃~+85℃; Voltage Rating: 100V; Plastic Material: PA66; Flame Retardant Rating: UL94V-0; Supplementary Features: K Pin; Color: White; Z-Height of the Board: 4.8mm; X-Length of Bottom Edge on Board (Spacing Line): 5.9mm; Y-Width of Bottom Edge on Board: 7.6mm
U6 = W25Q16JVSNIQ_C2456211: Supplier Part: C2456211; Manufacturer: WINBOND(华邦); Supplier Footprint: SOIC-8; JLCPCB Part Class: Extended Part; Datasheet: https://atta.szlcsc.com/upload/public/pdf/source/20190529/C115407_78E5B4F96E7138D299EC51EC5982A1A5.pdf; Supplier: LCSC
U7 = RP2040_C2040: CPU Core:- RAM Size:264KB GPIO Ports Number:30 Operating Voltage Range:- Operating Voltage Range:- CPU Maximum Speed:133MHz Program Memory Type:- Operating Temperature Range:- Operating Temperature Range:- ADC (Bit):12bit DAC (Bit):- PWM (Bit):- 8Bit Time; LCSC Part Name: RP2040（RP2B2）; Supplier Part: C2040; Manufacturer: Raspberry Pi(树莓派); Supplier Footprint: LQFN-56(7x7); JLCPCB Part Class: Extended Part; Datasheet: https://atta.szlcsc.com/upload/public/pdf/source/20210621/C2040_96F425825606B7957D87DD32E2512CA9.pdf; Supplier: LCSC; RAM Size: 264KB; GPIO Ports Number: 30; CPU Maximum Speed: 133MHz; ADC (Bit): 12bit; UART/USART: 2; I2C: 2; SPI: 2; Universal Serial Bus: 有; Peripheral/Function: DMA；PWM; Direct Memory Access: 有
U8 = MIC5504-3.3YM5-TR: Output Type: Maximum Input Voltage:5.5V Output Voltage:3.3V Output Voltage:3.3V MAX Output Current:300mA Power Supply Rejection Ratio (PSRR):60dB@(1kHz) Dropout Voltage:380mV@(300mA) standby current:55uA Operating Temperature:-40℃~+125℃ Operating Temperat; LCSC Part Name: 输入5.5V 输出3.3V 300mA; Supplier Part: C88419; Manufacturer: MICROCHIP(美国微芯); Supplier Footprint: SOT-23-5; JLCPCB Part Class: Extended Part; Datasheet: https://atta.szlcsc.com/upload/public/pdf/source/20180329/C95749_2D03E2CDCEE40DDAAF1BC13608301412.pdf; Supplier: LCSC; Maximum Input Voltage: 5.5V; Output Voltage: 3.3V; MAX Output Current: 300mA; Power Supply Rejection Ratio (PSRR): 60dB@(1kHz); Dropout Voltage: 380mV@(300mA); standby current: 55uA; Operating Temperature: -40℃~+125℃; Output Polarity: Positive electrode; Number of Outputs: 1
U9 U10 = DS1021-1x22SF11-B: Pin Structure:1x22P Pitch:2.54mm Circluar Pins/Square Pins:Pin Header Mounting Type:Through Hole Number of Rows:1 Number of Pins:22P Current Rating:3A Voltage Rating (Max):250V Contact Material:Copper Alloy Contact Plating:Gold Operating Temperature:-40℃~; LCSC Part Name: 1x22P 间距:2.54mm 方针 直插; Supplier Part: C7430378; Manufacturer: CONNFLY; Supplier Footprint: 插件,P=2.54mm; JLCPCB Part Class: Extended Part; Datasheet: https://item.szlcsc.com/datasheet/DS1021-1x22SF11-B/8430031.html; Supplier: LCSC; Pin Structure: 1x22P; Pitch: 2.54mm; Circluar Pins/Square Pins: Pin Header; Mounting Type: Through Hole; Number of Rows: 1; Number of Pins: 22P; Current Rating: 3A; Voltage Rating (Max): 250V; Contact Material: Copper Alloy; Contact Plating: Gold; Operating Temperature: -40℃~+105℃; Color: Black
U11 = CH334F_C5187527: type:Hub USB Protocol:USB 2.0 Data Rate:480Mbps Voltage - Supply:5V；3.3V Voltage - Supply:5V；3.3V Operating Temperature:-40℃~+85℃ Operating Temperature:-40℃~+85℃; Supplier Part: C5187527; Manufacturer: WCH(南京沁恒); Supplier Footprint: QFN-24(4x4); JLCPCB Part Class: Extended Part; Datasheet: https://item.szlcsc.com/datasheet/CH334F/5860925.html; Supplier: LCSC; type: Hub; USB Protocol: USB 2.0; Data Rate: 480Mbps; Voltage - Supply: 5V；3.3V; Operating Temperature: -40℃~+85℃
U12 = SX3B12.000F1510F30: Type:Crystal Oscillator Frequency:12MHz Normal temperature Frequency Tolerance:±10ppm Normal temperature Frequency Tolerance:±10ppm Load Capacitance:15pF Frequency Stability:±30ppm Frequency Stability:±30ppm Equivalent Series Resistance(ESR):100Ω Operatin; LCSC Part Name: 12MHz ±10ppm 15pF; Supplier Part: C2901651; Manufacturer: SCTF(星通时频); Supplier Footprint: SMD3225-4P; JLCPCB Part Class: Extended Part; Datasheet: https://item.szlcsc.com/datasheet/SX3B12.000F1510F30/3151464.html; Supplier: LCSC; Type: Crystal Oscillator; Normal temperature Frequency Tolerance: ±10ppm; Load Capacitance: 15pF; Frequency Stability: ±30ppm; Equivalent Series Resistance(ESR): 100Ω; Operating Temperature: -40℃~+85℃
U13 = XL-3030RGBC-2812B: Wavelength:620nm~630nm；515nm~525nm；465nm~475nm Luminous Intensity:300mcd；800mcd；200mcd Fixed-Frequency Pwm Mode:1.5kHz Data Transmission Rate:800Kbit/s Voltage - Supply:3.5V~5.5V Voltage - Supply:3.5V~5.5V Quiescent Current:0.5mA Lens Color:Translucent Fr; LCSC Part Name: 幻彩透明 XL-3030RGBC-WS2812B; Supplier Part: C5349958; Manufacturer: XINGLIGHT(成兴光); Supplier Footprint: SMD3030-4P; JLCPCB Part Class: Extended Part; Datasheet: https://item.szlcsc.com/datasheet/XL-3030RGBC-2812B/6136407.html; Supplier: LCSC; Wavelength: 620nm~630nm；515nm~525nm；465nm~475nm; Luminous Intensity: 300mcd；800mcd；200mcd; Fixed-Frequency Pwm Mode: 1.5kHz; Data Transmission Rate: 800Kbit/s; Voltage - Supply: 3.5V~5.5V; Quiescent Current: 0.5mA; Lens Color: Translucent Frosted Lens; ESD Withstand Voltage: 2000V; Installation method: op View Mount; Operating Temperature: -20℃~+85℃; Peak Wavelength: R:625nm；B:470nm；G:525nm; Viewing Angle: 120°; Length: 3mm; Width: 1.1mm; Height: 3mm
U14 = CH343P: Applications Function:USB to UART USB Protocol:USB 2.0 Number of Channels:- Voltage - Supply:3.3V；5V Voltage - Supply:3.3V；5V Data Rate:6Mbps Operating Temperature:-40℃~+85℃ Operating Temperature:-40℃~+85℃; Supplier Part: C2846043; Manufacturer: WCH(南京沁恒); Supplier Footprint: TQFN-16-EP(3x3); JLCPCB Part Class: Extended Part; Datasheet: https://item.szlcsc.com/datasheet/CH343P/3039795.html; Supplier: LCSC; Applications Function: USB to UART; USB Protocol: USB 2.0; Voltage - Supply: 3.3V；5V; Data Rate: 6Mbps; Operating Temperature: -40℃~+85℃
U15 = AMS1117-3.3_C347222: Output Type:Fixed Voltage - Supply:12V Output Voltage:3.3V Output Voltage:3.3V Output Current:1A Power Supply Rejection Ratio (PSRR):60dB@(120Hz) Voltage Dropout:1.3V@(1A) standby current:5mA Noise:0.003%Vout Features:Over Current Protection Operating Tem; LCSC Part Name: 输出:3.3V 电流:1A 耐压:12V; Supplier Part: C347222; Manufacturer: UMW(友台半导体); Supplier Footprint: SOT-223; JLCPCB Part Class: Extended Part; Datasheet: https://item.szlcsc.com/datasheet/AMS1117-3.3/323882.html; Supplier: LCSC; Output Type: Fixed; Voltage - Supply: 12V; Output Voltage: 3.3V; Output Current: 1A; Power Supply Rejection Ratio (PSRR): 60dB@(120Hz); Voltage Dropout: 1.3V@(1A); standby current: 5mA; Noise: 0.003%Vout; Features: Over Current Protection; Operating Temperature: -40℃~+125℃; Output Configuration: Positive; Number of Outputs: 1
U16 = MAX98357AETE+T: Class:Class D Speaker Channels:- Output Power:3.2W×1@4Ω Voltage - Supply:2.5V~5.5V Voltage - Supply:2.5V~5.5V Total Harmonic Distortion + Noise (THD+N):- Quiescent Current:2.4mA Operating Temperature:-40℃~+85℃ Operating Temperature:-40℃~+85℃ Power Supply; LCSC Part Name: 微型、低成本、PCM 类 D 级放大器具有 AB 级性能; Supplier Part: C910544; Manufacturer: ADI(亚德诺)/MAXIM(美信); Supplier Footprint: TQFN-16-EP(3x3); JLCPCB Part Class: Extended Part; Datasheet: https://item.szlcsc.com/datasheet/MAX98357AETE%252BT/978950.html; Supplier: LCSC; Class: Class D; Output Power: 3.2W×1@4Ω; Voltage - Supply: 2.5V~5.5V; Quiescent Current: 2.4mA; Operating Temperature: -40℃~+85℃; Power Supply Rejection Ratio (PSRR): 77dB; Efficiency: 92%
U17 U25 = KF301-5.0-2P: Structure:1x2P Pitch:5mm Color:Blue Mounting Style:Straight Current Rating (Max):17A Voltage Rating (Max):250V Number of Pins:2P Number of Rows:1 Wire Gauge - AWG:14~22 Wire Gauge - AWG:14~22 Wire Gauge - mm2:1.5 Wire Gauge - mm2:1.5 Number of PINs Per Ro; LCSC Part Name: 5mm 1x2P 排数:1 每排P数:2 直插; Supplier Part: C474881; Manufacturer: KEFA(科发); Supplier Footprint: 插件,P=5mm; JLCPCB Part Class: Extended Part; Datasheet: https://atta.szlcsc.com/upload/public/pdf/source/20230317/03A5B5FC229D6F9225E8F51DA1A4E80A.pdf; Supplier: LCSC; Structure: 1x2P; Pitch: 5mm; Color: Blue; Mounting Style: Straight; Current Rating (Max): 17A; Voltage Rating (Max): 250V; Number of Pins: 2P; Number of Rows: 1; Wire Gauge - AWG: 14~22; Wire Gauge - mm2: 1.5; Number of PINs Per Row: 2; Operating Temperature Range: -30℃~+120℃
U18-U21 = HB-PH3-25417PB2GOP: Pin Structure:1x7P Pitch:2.54mm Row Spacing:2.54mm Circluar Pins/Square Pins:Pin Header Mounting Type:Through Hole Number of Rows:1 Number of Pins:7P Current Rating:3A Voltage Rating (Max):250V Length of Mating Pin:6mm Insulation Height:2.54mm Length of E; LCSC Part Name: 1x7P 间距:2.54mm 方针 直插; Supplier Part: C6332200; Manufacturer: HANBO(汉博); Supplier Footprint: 插件,P=2.54mm; JLCPCB Part Class: Extended Part; Datasheet: https://item.szlcsc.com/datasheet/HB-PH3-25417PB2GOP/7280440.html; Supplier: LCSC; Pin Structure: 1x7P; Pitch: 2.54mm; Row Spacing: 2.54mm; Circluar Pins/Square Pins: Pin Header; Mounting Type: Through Hole; Number of Rows: 1; Number of Pins: 7P; Current Rating: 3A; Voltage Rating (Max): 250V; Length of Mating Pin: 6mm; Insulation Height: 2.54mm; Length of End Connection Pin: 3mm; Contact Material: Brass; Contact Plating: Gold; Operating Temperature: -40℃~+105℃; Color: Black
USBC1-USBC3 = TYPE-C-31-M-12: Connector Type:Type-C Protocol Standard:- Gender:Female Mounting Type:- Number of Contacts:16P Number of Ports:1 Current Rating-Power:5A Operating Temperature:- Operating Temperature:-; LCSC Part Name: Type-C 母; Supplier Part: C165948; Manufacturer: 韩国韩荣; Supplier Footprint: SMD; JLCPCB Part Class: Extended Part; Datasheet: https://item.szlcsc.com/datasheet/TYPE-C-31-M-12/177331.html; Supplier: LCSC; Connector Type: Type-C; Gender: Female; Number of Contacts: 16P; Number of Ports: 1; Current Rating-Power: 5A
X1 = CSTNE12M0G52A000R0: Frequency: Built-in Load Capacitance: Resonant Impedance: Operating Temperature:-40℃~+125℃ Operating Temperature:-40℃~+125℃; LCSC Part Name: 12MHz ±0.5% 内置负载电容:10pF; Supplier Part: C907957; Manufacturer: muRata(村田); Supplier Footprint: SMD3213-3P; JLCPCB Part Class: Extended Part; Datasheet: https://atta.szlcsc.com/upload/public/pdf/source/20201022/C907957_8E07C565874D4A99F6305262E18BC732.pdf; Supplier: LCSC; Operating Temperature: -40℃~+125℃

## Nets
1V1: C5.2 C9.2 U7.23(DVDD) U7.45(VREG_VOUT) U7.50(DVDD)
3V3: C4.2 C6.2 C7.2 C8.2 C11.2 C12.2 H1.2 H9.3 R8.2 U6.8(VCC) U7.1(IOVDD) U7.10(IOVDD) U7.22(IOVDD) U7.33(IOVDD) U7.42(IOVDD) U7.43(ADC_AVDD) U7.44(VREG_IN) U7.48(USB_VDD) U7.49(IOVDD) U8.5(VOUT)
3V3_OP: C16.2 C17.2 C22.1 C23.2 Q1.4(D2) U11.19(V5) U11.20(VDD33) U14.1(VIO) U14.3(VDD5)
GND: C1.1 C2.1 C3.2 C4.1 C5.1 C6.1 C7.1 C8.1 C9.1 C10.1 C11.1 C12.1 C13.1 C14.1 C15.2 C16.1 C17.1 C18.2 C19.2 C20.1 C21.2 C22.2 C23.1 C24.1 C25.1 C26.1 C27.1 C30.1 C32.1 C33.1 C34.1 C35.1 C36.1 C37.1 C38.1 CN1.3 CN1.4 H1.3 H1.4 H7.2 H8.4 H9.4 H10.5 H10.7 H11.3 H12.1 LED1.1(K) LED2.2(K) LED3.2(K) Q1.5(S1) R11.1 R12.1 R16.2 R26.1 R27.1 R29.1 R30.1 SW1.3 SW1.4 SW2.3 SW2.4 SW3.1 SW4.1 SW8.2 SW8.4 SW8.5 U1.1(GND) U1.40(GND) U1.41(GND) U2.5 U2.6 U3.2 U4.5 U4.6 U5.5 U5.6 U6.4(GND) U7.19(TESTEN) U7.57(GND) U8.2(GND) U9.1 U9.21 U9.22 U10.1 U11.25(GND) U12.2(GND) U12.4(GND) U13.3(GND/VSS) U14.2(GND) U14.17(EP) U15.1(ADJ(GND)) U15.4(TAB) U16.2(GAIN_SLOT) U16.3(GND) U16.11(GND) U16.15(GND) U16.17(EP) U19.6 U20.6 U22.5 U22.6 U23.5 U23.6 U24.5 U24.6 U25.2 USBC1.1(EH) USBC1.2(EH) USBC1.3(EH) USBC1.4(EH) USBC1.A1B12(GND) USBC1.B1A12(GND) USBC2.1(EH) USBC2.2(EH) USBC2.3(EH) USBC2.4(EH) USBC2.A1B12(GND) USBC2.B1A12(GND) USBC3.1(EH) USBC3.2(EH) USBC3.3(EH) USBC3.4(EH) USBC3.A1B12(GND) USBC3.B1A12(GND) X1.2
VBUS: C10.2 D1.2(A) D4.1(K) D6.1(K) USBC1.A4B9(VBUS) USBC1.B4A9(VBUS)
VBUSINESP: C2.2 C27.2 C32.2 C34.2 D2.1(K) D3.1(K) D5.1(K) R15.1 U10.2 U14.9(VBUS) U15.3(VIN)
#EN: C14.2 C25.2 Q3.3(C) R13.1 SW3.2 U1.3(EN) U10.20
D_N: SW5.4 U11.14(DMU) USBC2.A7(DN1) USBC2.B7(DN2)
D_P: SW5.1 U11.15(DPU) USBC2.A6(DP1) USBC2.B6(DP2)
DNIN: SW5.5 USBC3.A7(DN1) USBC3.B7(DN2)
DPIN: SW5.2 USBC3.A6(DP1) USBC3.B6(DP2)
DTR: Q2.2(E) R24.2 U14.12(DTRTNOW)
EIO0: R14.1 SW4.2 U1.27(IO0) U9.14
EIO1: C26.2 Q2.3(C) U1.39(IO1) U9.4
EIO2: U1.38(IO2) U9.5
EIO3: U1.15(IO3) U10.10
EIO4: H11.2 U1.4(IO4) U10.19
EIO5: H11.1 U1.5(IO5) U10.18
EIO6: H12.3 U1.6(IO6) U10.17
EIO7: H10.4 U1.7(IO7) U10.16 U16.1(DIN)
EIO8: U1.12(IO8) U10.11
EIO9: U1.17(IO9) U10.8
EIO10: U1.18(IO10) U10.7
EIO11: U1.19(IO11) U10.6
EIO12: U1.20(IO12) U10.5
EIO13: U1.21(IO13) U10.4
EIO14: U1.22(IO14) U10.3
EIO15: H10.3 U1.8(IO15) U10.15 U16.16(BCLK)
EIO16: H10.2 U1.9(IO16) U10.14 U16.14(LRCLK)
EIO17: H13.4 U1.10(IO17) U7.3(GPIO1) U10.13
EIO18: H13.5 U1.11(IO18) U7.2(GPIO0) U10.12
EIO19: U1.13(IO19) U9.20 U11.11(DM1)
EIO20: U1.14(IO20) U9.19 U11.12(DP1)
EIO21: U1.23(IO21) U9.18
EIO35: U1.28(IO35) U9.13
EIO36: U1.29(IO36) U9.12
EIO37: U1.30(IO37) U9.11
EIO38: R20.1 U1.31(IO38) U9.10
EIO39: U1.32(IO39) U9.9
EIO40: U1.33(IO40) U9.8
EIO41: H8.1 U1.34(IO41) U9.7
EIO42: H8.2 U1.35(IO42) U9.6
EIO45: U1.26(IO45) U9.15
EIO46: U1.16(IO46) U10.9
EIO47: U1.24(IO47) U9.17
EIO48: U1.25(IO48) U9.16
EIORX: R22.1 U1.36(RXD0) U9.3
EIOTX: R23.1 U1.37(TXD0) U9.2
ESP3V3: R13.2 R14.2
GPIO2: H13.3 U7.4(GPIO2)
GPIO3: H13.2 U7.5(GPIO3)
GPIO4: H13.1 U7.6(GPIO4) U18.7 U21.7
GPIO5: H14.5 U7.7(GPIO5) U19.1 U20.1
GPIO6: H14.4 U7.8(GPIO6) U22.2
GPIO7: H14.3 U7.9(GPIO7) U22.1
GPIO8: H14.2 U2.2 U7.11(GPIO8)
GPIO9: H14.1 U2.1 U7.12(GPIO9)
GPIO10: H9.1 H15.5 U7.13(GPIO10)
GPIO11: H9.2 H15.4 U7.14(GPIO11)
GPIO12: H15.3 U5.2 U7.15(GPIO12)
GPIO13: H15.2 U5.1 U7.16(GPIO13)
GPIO14: H15.1 U4.2 U7.17(GPIO14)
GPIO15: H16.5 U4.1 U7.18(GPIO15)
GPIO16: H16.4 U7.27(GPIO16) U24.2
GPIO17: H16.3 U7.28(GPIO17) U24.1
GPIO18: H16.2 U7.29(GPIO18) U23.2
GPIO19: H16.1 U7.30(GPIO19) U23.1
GPIO20: H17.5 SW8.1 U7.31(GPIO20)
GPIO21: H17.4 U7.32(GPIO21)
GPIO22: H17.3 U7.34(GPIO22)
GPIO26: H17.2 U7.38(GPIO26_ADC0)
GPIO27: H17.1 U7.39(GPIO27_ADC1)
GPIO28: H1.5 U7.40(GPIO28_ADC2)
MAXVDD: C13.2 C20.2 C30.2 C33.2 C35.2 C36.2 H8.3 H10.6 H10.8 H12.2 Q1.2(S2) R17.1 R21.2 R28.1 R28.2 U1.2(3V3) U10.21 U10.22 U13.1(VDD) U15.2(VOUT(TAB)) U16.4(SD_MODE#) U16.7(VDD) U16.8(VDD)
NET15: L1.2 U16.9(OUTP)
NET16: L2.2 U16.10(OUTN)
QSPI_SCLK: U6.6(CLK) U7.52(QSPI_SCLK)
QSPI_SD0: U6.5(DI/IO0) U7.53(QSPI_SD0)
QSPI_SD1: U6.2(DO/IO1) U7.55(QSPI_SD1)
QSPI_SD2: U6.3(WP#/IO2) U7.54(QSPI_SD2)
QSPI_SD3: U6.7(HOLD#/RESET#/IO3) U7.51(QSPI_SD3)
QSPI_SS: R9.2 U6.1(CS#) U7.56(QSPI_SS)
RGB_CTRL: R20.2 U13.4(DIN)
RTS: Q3.2(E) R25.2 U14.13(RTS)
RUN: SW2.1 SW2.2 U7.26(RUN)
SWCLK: H7.1 U7.24(SWCLK)
SWDIO: H7.3 U7.25(SWD)
USB2_N: U11.9(DM2) U14.8(UD-)
USB2_P: U11.10(DP2) U14.7(UD+)
USB_DM: SW5.6 U7.46(USB_DM) USBC1.A7(DN1) USBC1.B7(DN2)
USB_DP: SW5.3 U7.47(USB_DP) USBC1.A6(DP1) USBC1.B6(DP2)
V+: C3.1 C15.1 C21.1 D7.1 U2.3 U2.4 U4.3 U4.4 U5.3 U5.4 U22.3 U22.4 U23.3 U23.4 U24.3 U24.4
VSYS: C1.2 D1.1(C) H1.1 U8.1(VIN) U8.3(EN) U19.7 U20.7
XI: C18.1 R19.2 U11.4(XI) U12.1
XO: R18.2 R19.1 U11.3(XO)
$1N1870: R9.1 SW1.1 SW1.2
$1N1872: U7.21(XOUT) X1.3
$1N1873: U7.20(XIN) X1.1
$1N1896: LED2.1(A) R7.1
$1N1897: R7.2 U7.37(GPIO25)
$1N2181: R12.2 USBC1.B5(CC2)
$1N2182: R11.2 USBC1.A5(CC1)
$1N3810: Q1.1(G1) R15.2 R16.1
$1N3984: Q1.3(G2) Q1.6(D1) R17.2
$1N4724: C19.1 R18.1 U12.3
$1N5316: LED3.1(A) R21.1
$1N6114: R22.2 U14.4(TXD)
$1N6119: R23.2 U14.5(RXD)
$1N6176: C24.2 U14.6(V3)
$1N6413: Q3.1(B) R24.1
$1N6452: Q2.1(B) R25.1
$1N6986: D3.2(A) USBC2.A4B9(VBUS) USBC2.B4A9(VBUS)
$1N7041: R26.2 USBC2.A5(CC1)
$1N7109: R27.2 USBC2.B5(CC2)
$1N7689: LED1.2(A) R8.1
$1N13425: C38.2 CN1.1 L1.1 U17.2
$1N13429: C37.2 CN1.2 L2.1 U17.1
$1N14871: U19.2 U20.2
$1N14876: U19.3 U20.3
$1N14881: U19.4 U20.4
$1N14886: U19.5 U20.5
$1N14907: U18.1 U21.1
$1N14912: U18.2 U21.2
$1N14917: U18.3 U21.3
$1N14922: U18.4 U21.4
$1N14927: U18.5 U21.5
$1N14932: U18.6 U21.6
$1N15236: R30.2 USBC3.B5(CC2)
$1N15239: D4.2(A) D5.2(A) USBC3.A4B9(VBUS) USBC3.B4A9(VBUS)
$1N15244: R29.2 USBC3.A5(CC1)
$1N16557: D2.2(A) D6.2(A) D7.2 U3.1 U25.1

Not connected (* = marked no-connect by the designer): H10 1*; SW8 3; U7 35(GPIO23)* 36(GPIO24)* 41(GPIO29_ADC3)*; U8 4(NC)*; U11 1(OVCUR#)* 2(NC.)* 5(DM4)* 6(DP4)* 7(DM3)* 8(DP3)* 13(LED3/SCL)* 16(RESET#/CDP)* 17(NC)* 18(PSELF)* 21(LED4/SDA)* 22(LED1)* 23(LED2)* 24(PWREN#)*; U13 2(DOUT)*; U14 10(ACT#)* 11(DCD)* 14(DSR)* 15(CTS)* 16(RI)*; U16 5(N.C.)* 6(N.C.)* 12(N.C.)* 13(N.C.)*; USBC1 A8(SBU1)* B8(SBU2)*; USBC2 A8(SBU1)* B8(SBU2)*; USBC3 A8(SBU1)* B8(SBU2)*

## Notes on the sheet
- ESP32-S3 N16R8
- RP2040
- KEY_FLASH
- RESET
- USB-C - Pico
- Key
- ESP
- ESP
- 3.3V Regulator
- Grove
- Grove
- Servos
- Servos
- Servos
- Servos
- Monitor
- Monitor
- Servos
- Servos
- Servos
- Servos
- Servos
- Servos
- Servos
- Servos
- Boot Switch
- Flash Memory
- Run Switch
- Hub
- LEDs
- Main
  Power
- PICO IO
- USB to UART
- Power
- Servos
- LR
- SCK
- WS
- ESP RX
- Pico TX
- Mic Connector
- ESP TX
- Pico RX
- ESP - Pico Bridge
- Amplifier
- SDA
- SDA
- Grove RX
- Pico TX1
- SCL
- SCL
- Grove TX
- Pico RX1
- USB Selector (Experimental)
- 3V3
- 3V3
- GND
- GND
- ESP Monitor
- Pico Monitor
- Debug Monitors
- Grove Vision AI V2
